# EAGLE schematic untitled (EAGLE 9.1.3)

## Sheet 1 of 6: led matrix
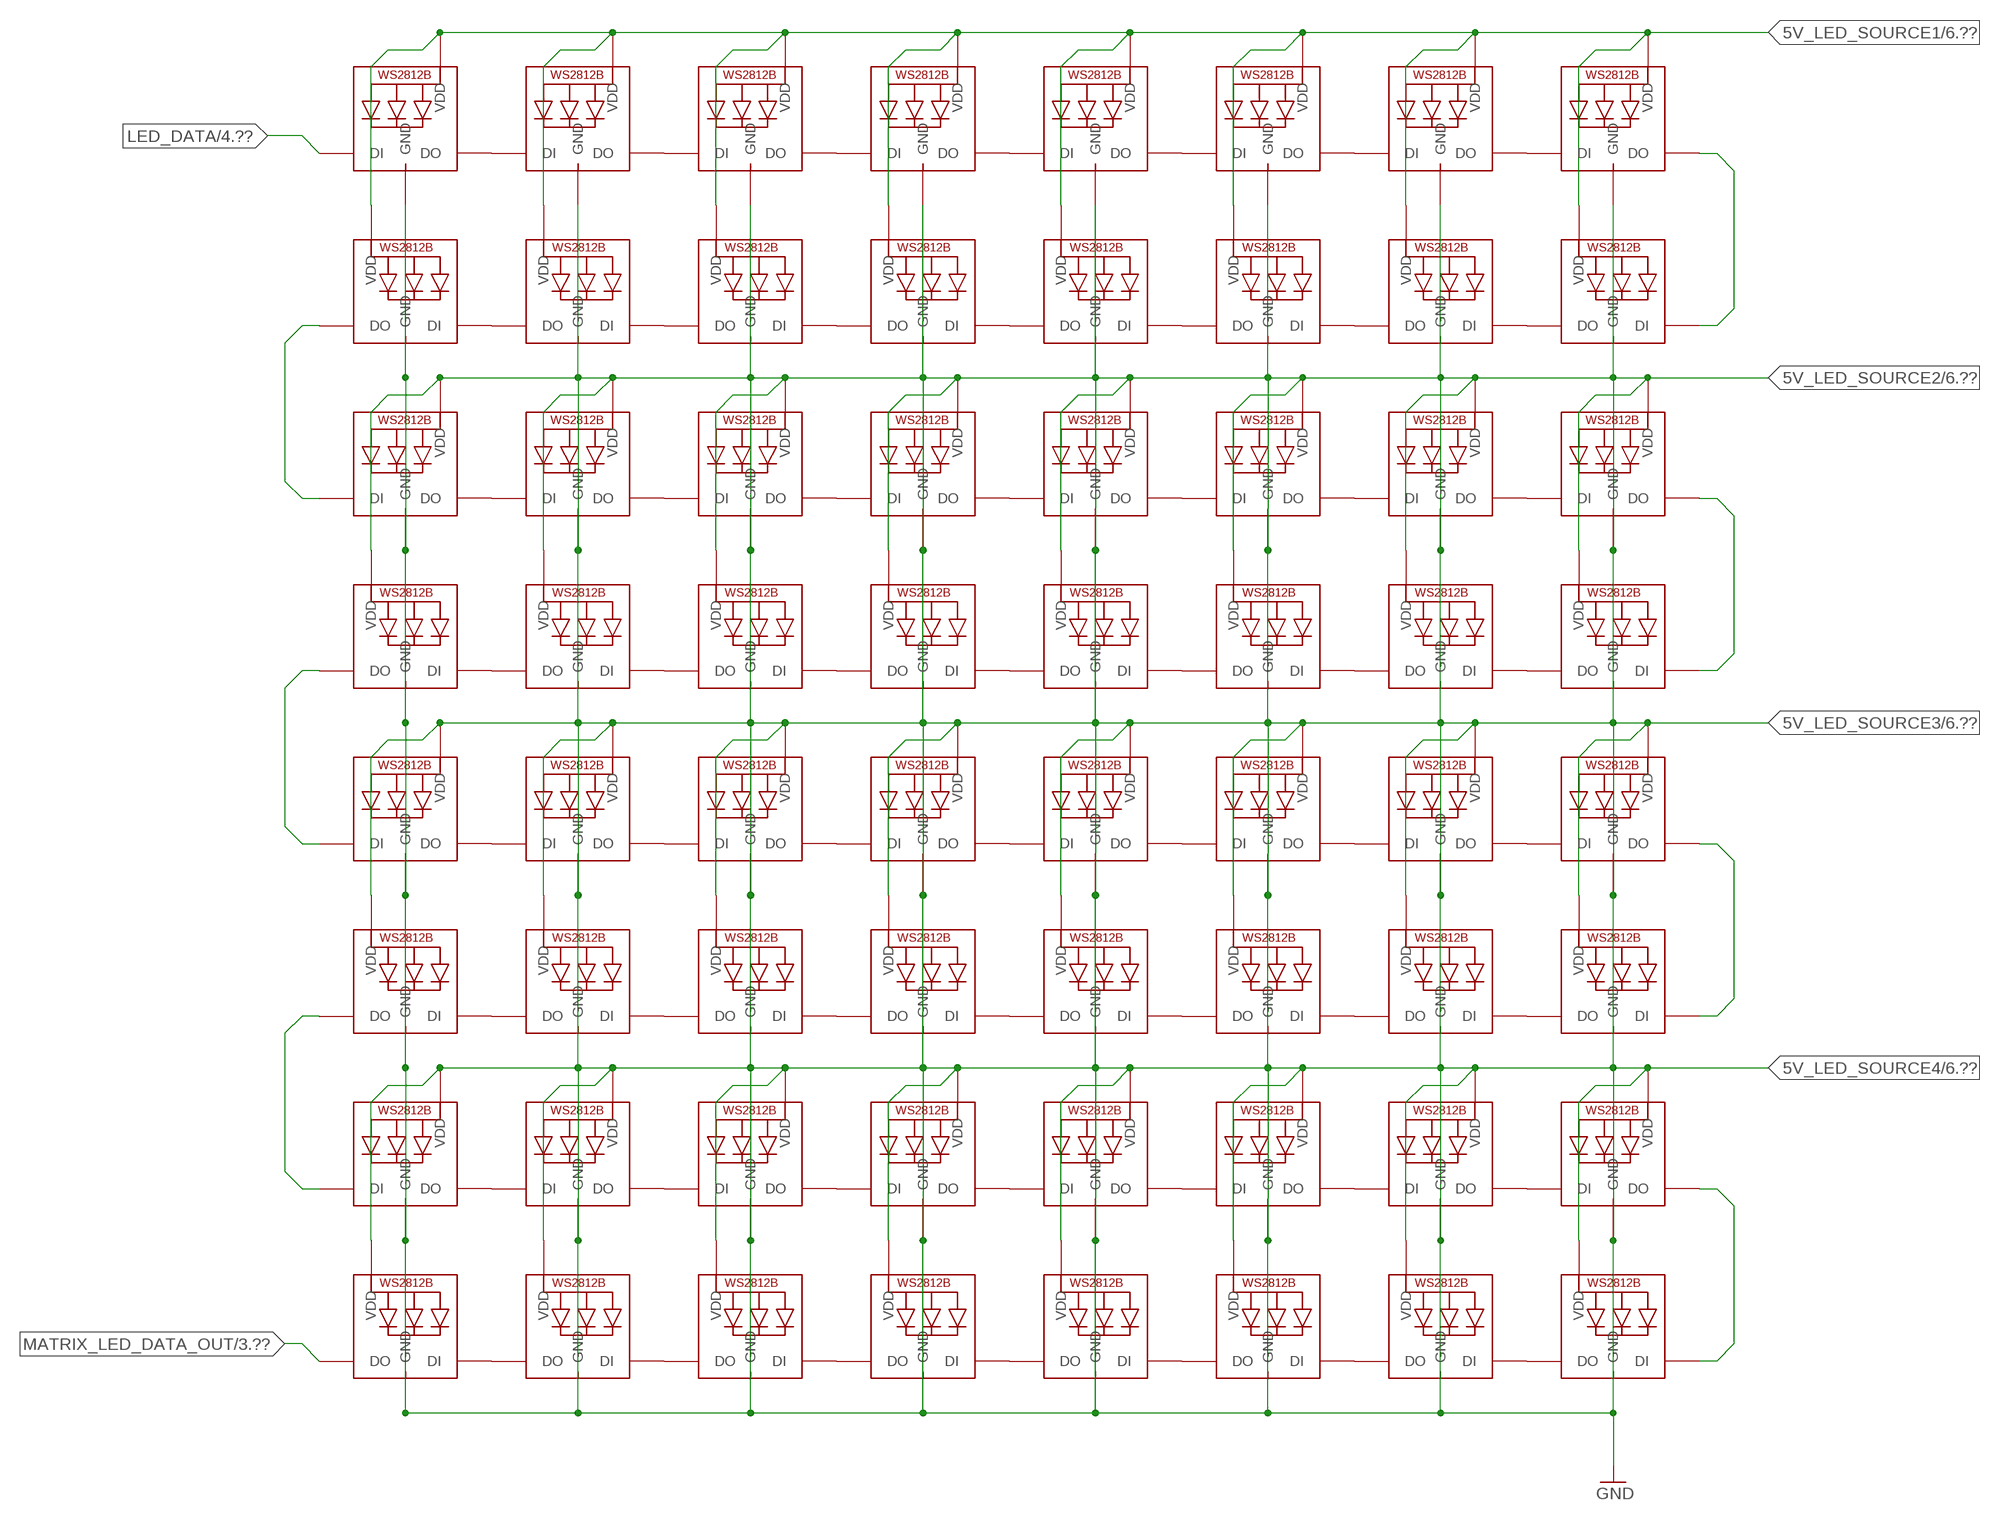
[diagram p0: schematic, sheet 1]

### Parts
LED1  WS2812B3535  [LED3535]
LED2  WS2812B3535  [LED3535]
LED3  WS2812B3535  [LED3535]
LED4  WS2812B3535  [LED3535]
LED5  WS2812B3535  [LED3535]
LED6  WS2812B3535  [LED3535]
LED7  WS2812B3535  [LED3535]
LED8  WS2812B3535  [LED3535]
LED9  WS2812B3535  [LED3535]
LED10  WS2812B3535  [LED3535]
LED11  WS2812B3535  [LED3535]
LED12  WS2812B3535  [LED3535]
LED13  WS2812B3535  [LED3535]
LED14  WS2812B3535  [LED3535]
LED15  WS2812B3535  [LED3535]
LED16  WS2812B3535  [LED3535]
LED17  WS2812B3535  [LED3535]
LED18  WS2812B3535  [LED3535]
LED19  WS2812B3535  [LED3535]
LED20  WS2812B3535  [LED3535]
LED21  WS2812B3535  [LED3535]
LED22  WS2812B3535  [LED3535]
LED23  WS2812B3535  [LED3535]
LED24  WS2812B3535  [LED3535]
LED25  WS2812B3535  [LED3535]
LED26  WS2812B3535  [LED3535]
LED27  WS2812B3535  [LED3535]
LED28  WS2812B3535  [LED3535]
LED29  WS2812B3535  [LED3535]
LED30  WS2812B3535  [LED3535]
LED31  WS2812B3535  [LED3535]
LED32  WS2812B3535  [LED3535]
LED33  WS2812B3535  [LED3535]
LED34  WS2812B3535  [LED3535]
LED35  WS2812B3535  [LED3535]
LED36  WS2812B3535  [LED3535]
LED37  WS2812B3535  [LED3535]
LED38  WS2812B3535  [LED3535]
LED39  WS2812B3535  [LED3535]
LED40  WS2812B3535  [LED3535]
LED41  WS2812B3535  [LED3535]
LED42  WS2812B3535  [LED3535]
LED43  WS2812B3535  [LED3535]
LED44  WS2812B3535  [LED3535]
LED45  WS2812B3535  [LED3535]
LED46  WS2812B3535  [LED3535]
LED47  WS2812B3535  [LED3535]
LED48  WS2812B3535  [LED3535]
LED49  WS2812B3535  [LED3535]
LED50  WS2812B3535  [LED3535]
LED51  WS2812B3535  [LED3535]
LED52  WS2812B3535  [LED3535]
LED53  WS2812B3535  [LED3535]
LED54  WS2812B3535  [LED3535]
LED55  WS2812B3535  [LED3535]
LED56  WS2812B3535  [LED3535]
LED57  WS2812B3535  [LED3535]
LED58  WS2812B3535  [LED3535]
LED59  WS2812B3535  [LED3535]
LED60  WS2812B3535  [LED3535]
LED61  WS2812B3535  [LED3535]
LED62  WS2812B3535  [LED3535]
LED63  WS2812B3535  [LED3535]
LED64  WS2812B3535  [LED3535]

### Nets
5V_LED_SOURCE1: LED1.2(VDD) LED2.2(VDD) LED3.2(VDD) LED4.2(VDD) LED5.2(VDD) LED6.2(VDD) LED7.2(VDD) LED8.2(VDD) LED9.2(VDD) LED10.2(VDD) LED11.2(VDD) LED12.2(VDD) LED13.2(VDD) LED14.2(VDD) LED15.2(VDD) LED16.2(VDD) ; also sheet 6
5V_LED_SOURCE2: LED17.2(VDD) LED18.2(VDD) LED19.2(VDD) LED20.2(VDD) LED21.2(VDD) LED22.2(VDD) LED23.2(VDD) LED24.2(VDD) LED25.2(VDD) LED26.2(VDD) LED27.2(VDD) LED28.2(VDD) LED29.2(VDD) LED30.2(VDD) LED31.2(VDD) LED32.2(VDD) ; also sheet 6
5V_LED_SOURCE3: LED33.2(VDD) LED34.2(VDD) LED35.2(VDD) LED36.2(VDD) LED37.2(VDD) LED38.2(VDD) LED39.2(VDD) LED40.2(VDD) LED41.2(VDD) LED42.2(VDD) LED43.2(VDD) LED44.2(VDD) LED45.2(VDD) LED46.2(VDD) LED47.2(VDD) LED48.2(VDD) ; also sheet 6
5V_LED_SOURCE4: LED49.2(VDD) LED50.2(VDD) LED51.2(VDD) LED52.2(VDD) LED53.2(VDD) LED54.2(VDD) LED55.2(VDD) LED56.2(VDD) LED57.2(VDD) LED58.2(VDD) LED59.2(VDD) LED60.2(VDD) LED61.2(VDD) LED62.2(VDD) LED63.2(VDD) LED64.2(VDD) ; also sheet 6
GND: LED1.4(GND) LED2.4(GND) LED3.4(GND) LED4.4(GND) LED5.4(GND) LED6.4(GND) LED7.4(GND) LED8.4(GND) LED9.4(GND) LED10.4(GND) LED11.4(GND) LED12.4(GND) LED13.4(GND) LED14.4(GND) LED15.4(GND) LED16.4(GND) LED17.4(GND) LED18.4(GND) LED19.4(GND) LED20.4(GND) LED21.4(GND) LED22.4(GND) LED23.4(GND) LED24.4(GND) LED25.4(GND) LED26.4(GND) LED27.4(GND) LED28.4(GND) LED29.4(GND) LED30.4(GND) LED31.4(GND) LED32.4(GND) LED33.4(GND) LED34.4(GND) LED35.4(GND) LED36.4(GND) LED37.4(GND) LED38.4(GND) LED39.4(GND) LED40.4(GND) LED41.4(GND) LED42.4(GND) LED43.4(GND) LED44.4(GND) LED45.4(GND) LED46.4(GND) LED47.4(GND) LED48.4(GND) LED49.4(GND) LED50.4(GND) LED51.4(GND) LED52.4(GND) LED53.4(GND) LED54.4(GND) LED55.4(GND) LED56.4(GND) LED57.4(GND) LED58.4(GND) LED59.4(GND) LED60.4(GND) LED61.4(GND) LED62.4(GND) LED63.4(GND) LED64.4(GND) ; also sheet 2,3,4,5,6
LED_DATA: LED1.1(DI) ; also sheet 4
MATRIX_LED_DATA_OUT: LED57.3(DO) ; also sheet 3
N$1: LED9.1(DI) LED10.3(DO)
N$2: LED10.1(DI) LED11.3(DO)
N$3: LED11.1(DI) LED12.3(DO)
N$4: LED12.1(DI) LED13.3(DO)
N$5: LED13.1(DI) LED14.3(DO)
N$6: LED14.1(DI) LED15.3(DO)
N$7: LED15.1(DI) LED16.3(DO)
N$8: LED25.1(DI) LED26.3(DO)
N$9: LED26.1(DI) LED27.3(DO)
N$10: LED27.1(DI) LED28.3(DO)
N$11: LED28.1(DI) LED29.3(DO)
N$12: LED29.1(DI) LED30.3(DO)
N$13: LED30.1(DI) LED31.3(DO)
N$14: LED31.1(DI) LED32.3(DO)
N$15: LED41.1(DI) LED42.3(DO)
N$16: LED42.1(DI) LED43.3(DO)
N$17: LED43.1(DI) LED44.3(DO)
N$18: LED44.1(DI) LED45.3(DO)
N$19: LED45.1(DI) LED46.3(DO)
N$20: LED46.1(DI) LED47.3(DO)
N$21: LED47.1(DI) LED48.3(DO)
N$22: LED1.3(DO) LED2.1(DI)
N$23: LED2.3(DO) LED3.1(DI)
N$24: LED3.3(DO) LED4.1(DI)
N$25: LED4.3(DO) LED5.1(DI)
N$26: LED5.3(DO) LED6.1(DI)
N$27: LED6.3(DO) LED7.1(DI)
N$28: LED7.3(DO) LED8.1(DI)
N$29: LED57.1(DI) LED58.3(DO)
N$30: LED24.3(DO) LED32.1(DI)
N$31: LED40.3(DO) LED48.1(DI)
N$32: LED56.3(DO) LED64.1(DI)
N$33: LED41.3(DO) LED49.1(DI)
N$34: LED25.3(DO) LED33.1(DI)
N$35: LED9.3(DO) LED17.1(DI)
N$36: LED58.1(DI) LED59.3(DO)
N$37: LED59.1(DI) LED60.3(DO)
N$38: LED60.1(DI) LED61.3(DO)
N$39: LED61.1(DI) LED62.3(DO)
N$40: LED62.1(DI) LED63.3(DO)
N$41: LED63.1(DI) LED64.3(DO)
N$45: LED17.3(DO) LED18.1(DI)
N$46: LED18.3(DO) LED19.1(DI)
N$47: LED19.3(DO) LED20.1(DI)
N$48: LED20.3(DO) LED21.1(DI)
N$49: LED21.3(DO) LED22.1(DI)
N$50: LED22.3(DO) LED23.1(DI)
N$51: LED23.3(DO) LED24.1(DI)
N$68: LED33.3(DO) LED34.1(DI)
N$69: LED34.3(DO) LED35.1(DI)
N$70: LED35.3(DO) LED36.1(DI)
N$71: LED36.3(DO) LED37.1(DI)
N$72: LED37.3(DO) LED38.1(DI)
N$73: LED38.3(DO) LED39.1(DI)
N$74: LED39.3(DO) LED40.1(DI)
N$91: LED49.3(DO) LED50.1(DI)
N$92: LED50.3(DO) LED51.1(DI)
N$93: LED51.3(DO) LED52.1(DI)
N$94: LED52.3(DO) LED53.1(DI)
N$95: LED53.3(DO) LED54.1(DI)
N$96: LED54.3(DO) LED55.1(DI)
N$97: LED55.3(DO) LED56.1(DI)
N$114: LED8.3(DO) LED16.1(DI)

## Sheet 2 of 6: button matrix
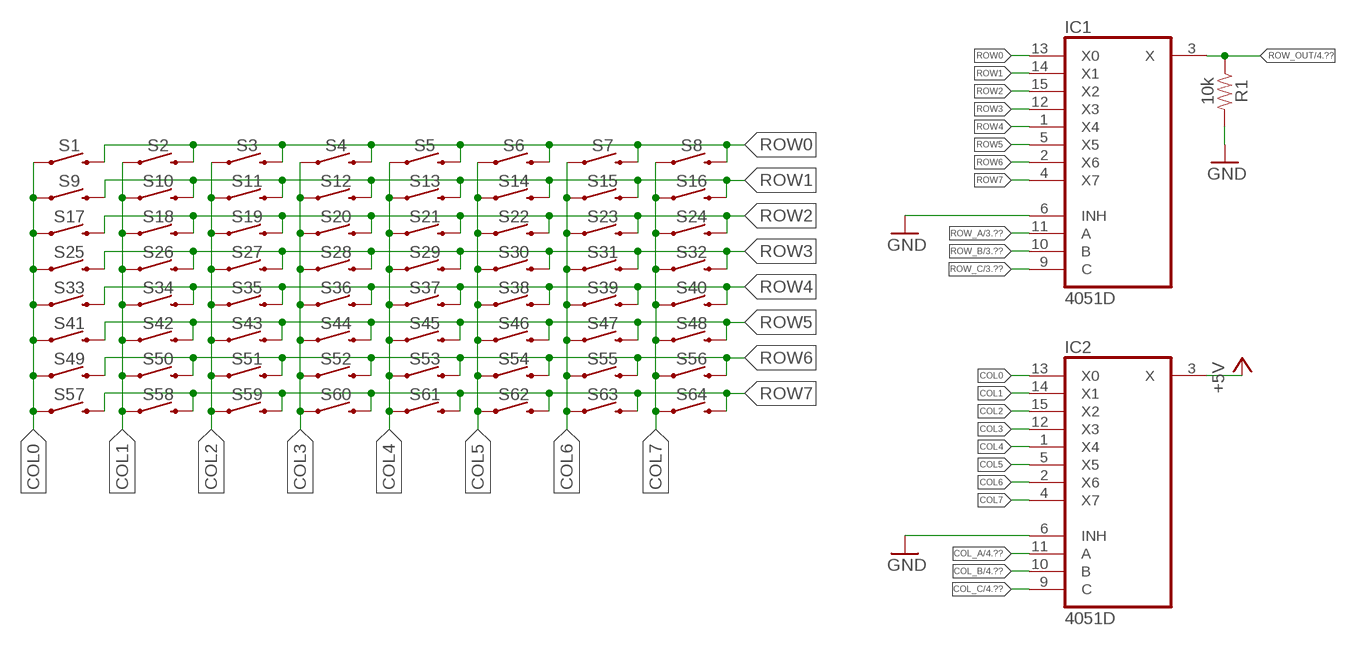
[diagram p1: schematic, sheet 2]

### Parts
IC1  4051D  [SO16]
IC2  4051D  [SO16]
R1  10k  10KOHM-0603-1/10W-1%  [0603]
S1  MOMENTARY-SWITCH-SPST-SMD-6.0X3.5MM  [TACTILE_SWITCH_SMD_6.0X3.5MM]
S2  MOMENTARY-SWITCH-SPST-SMD-6.0X3.5MM  [TACTILE_SWITCH_SMD_6.0X3.5MM]
S3  MOMENTARY-SWITCH-SPST-SMD-6.0X3.5MM  [TACTILE_SWITCH_SMD_6.0X3.5MM]
S4  MOMENTARY-SWITCH-SPST-SMD-6.0X3.5MM  [TACTILE_SWITCH_SMD_6.0X3.5MM]
S5  MOMENTARY-SWITCH-SPST-SMD-6.0X3.5MM  [TACTILE_SWITCH_SMD_6.0X3.5MM]
S6  MOMENTARY-SWITCH-SPST-SMD-6.0X3.5MM  [TACTILE_SWITCH_SMD_6.0X3.5MM]
S7  MOMENTARY-SWITCH-SPST-SMD-6.0X3.5MM  [TACTILE_SWITCH_SMD_6.0X3.5MM]
S8  MOMENTARY-SWITCH-SPST-SMD-6.0X3.5MM  [TACTILE_SWITCH_SMD_6.0X3.5MM]
S9  MOMENTARY-SWITCH-SPST-SMD-6.0X3.5MM  [TACTILE_SWITCH_SMD_6.0X3.5MM]
S10  MOMENTARY-SWITCH-SPST-SMD-6.0X3.5MM  [TACTILE_SWITCH_SMD_6.0X3.5MM]
S11  MOMENTARY-SWITCH-SPST-SMD-6.0X3.5MM  [TACTILE_SWITCH_SMD_6.0X3.5MM]
S12  MOMENTARY-SWITCH-SPST-SMD-6.0X3.5MM  [TACTILE_SWITCH_SMD_6.0X3.5MM]
S13  MOMENTARY-SWITCH-SPST-SMD-6.0X3.5MM  [TACTILE_SWITCH_SMD_6.0X3.5MM]
S14  MOMENTARY-SWITCH-SPST-SMD-6.0X3.5MM  [TACTILE_SWITCH_SMD_6.0X3.5MM]
S15  MOMENTARY-SWITCH-SPST-SMD-6.0X3.5MM  [TACTILE_SWITCH_SMD_6.0X3.5MM]
S16  MOMENTARY-SWITCH-SPST-SMD-6.0X3.5MM  [TACTILE_SWITCH_SMD_6.0X3.5MM]
S17  MOMENTARY-SWITCH-SPST-SMD-6.0X3.5MM  [TACTILE_SWITCH_SMD_6.0X3.5MM]
S18  MOMENTARY-SWITCH-SPST-SMD-6.0X3.5MM  [TACTILE_SWITCH_SMD_6.0X3.5MM]
S19  MOMENTARY-SWITCH-SPST-SMD-6.0X3.5MM  [TACTILE_SWITCH_SMD_6.0X3.5MM]
S20  MOMENTARY-SWITCH-SPST-SMD-6.0X3.5MM  [TACTILE_SWITCH_SMD_6.0X3.5MM]
S21  MOMENTARY-SWITCH-SPST-SMD-6.0X3.5MM  [TACTILE_SWITCH_SMD_6.0X3.5MM]
S22  MOMENTARY-SWITCH-SPST-SMD-6.0X3.5MM  [TACTILE_SWITCH_SMD_6.0X3.5MM]
S23  MOMENTARY-SWITCH-SPST-SMD-6.0X3.5MM  [TACTILE_SWITCH_SMD_6.0X3.5MM]
S24  MOMENTARY-SWITCH-SPST-SMD-6.0X3.5MM  [TACTILE_SWITCH_SMD_6.0X3.5MM]
S25  MOMENTARY-SWITCH-SPST-SMD-6.0X3.5MM  [TACTILE_SWITCH_SMD_6.0X3.5MM]
S26  MOMENTARY-SWITCH-SPST-SMD-6.0X3.5MM  [TACTILE_SWITCH_SMD_6.0X3.5MM]
S27  MOMENTARY-SWITCH-SPST-SMD-6.0X3.5MM  [TACTILE_SWITCH_SMD_6.0X3.5MM]
S28  MOMENTARY-SWITCH-SPST-SMD-6.0X3.5MM  [TACTILE_SWITCH_SMD_6.0X3.5MM]
S29  MOMENTARY-SWITCH-SPST-SMD-6.0X3.5MM  [TACTILE_SWITCH_SMD_6.0X3.5MM]
S30  MOMENTARY-SWITCH-SPST-SMD-6.0X3.5MM  [TACTILE_SWITCH_SMD_6.0X3.5MM]
S31  MOMENTARY-SWITCH-SPST-SMD-6.0X3.5MM  [TACTILE_SWITCH_SMD_6.0X3.5MM]
S32  MOMENTARY-SWITCH-SPST-SMD-6.0X3.5MM  [TACTILE_SWITCH_SMD_6.0X3.5MM]
S33  MOMENTARY-SWITCH-SPST-SMD-6.0X3.5MM  [TACTILE_SWITCH_SMD_6.0X3.5MM]
S34  MOMENTARY-SWITCH-SPST-SMD-6.0X3.5MM  [TACTILE_SWITCH_SMD_6.0X3.5MM]
S35  MOMENTARY-SWITCH-SPST-SMD-6.0X3.5MM  [TACTILE_SWITCH_SMD_6.0X3.5MM]
S36  MOMENTARY-SWITCH-SPST-SMD-6.0X3.5MM  [TACTILE_SWITCH_SMD_6.0X3.5MM]
S37  MOMENTARY-SWITCH-SPST-SMD-6.0X3.5MM  [TACTILE_SWITCH_SMD_6.0X3.5MM]
S38  MOMENTARY-SWITCH-SPST-SMD-6.0X3.5MM  [TACTILE_SWITCH_SMD_6.0X3.5MM]
S39  MOMENTARY-SWITCH-SPST-SMD-6.0X3.5MM  [TACTILE_SWITCH_SMD_6.0X3.5MM]
S40  MOMENTARY-SWITCH-SPST-SMD-6.0X3.5MM  [TACTILE_SWITCH_SMD_6.0X3.5MM]
S41  MOMENTARY-SWITCH-SPST-SMD-6.0X3.5MM  [TACTILE_SWITCH_SMD_6.0X3.5MM]
S42  MOMENTARY-SWITCH-SPST-SMD-6.0X3.5MM  [TACTILE_SWITCH_SMD_6.0X3.5MM]
S43  MOMENTARY-SWITCH-SPST-SMD-6.0X3.5MM  [TACTILE_SWITCH_SMD_6.0X3.5MM]
S44  MOMENTARY-SWITCH-SPST-SMD-6.0X3.5MM  [TACTILE_SWITCH_SMD_6.0X3.5MM]
S45  MOMENTARY-SWITCH-SPST-SMD-6.0X3.5MM  [TACTILE_SWITCH_SMD_6.0X3.5MM]
S46  MOMENTARY-SWITCH-SPST-SMD-6.0X3.5MM  [TACTILE_SWITCH_SMD_6.0X3.5MM]
S47  MOMENTARY-SWITCH-SPST-SMD-6.0X3.5MM  [TACTILE_SWITCH_SMD_6.0X3.5MM]
S48  MOMENTARY-SWITCH-SPST-SMD-6.0X3.5MM  [TACTILE_SWITCH_SMD_6.0X3.5MM]
S49  MOMENTARY-SWITCH-SPST-SMD-6.0X3.5MM  [TACTILE_SWITCH_SMD_6.0X3.5MM]
S50  MOMENTARY-SWITCH-SPST-SMD-6.0X3.5MM  [TACTILE_SWITCH_SMD_6.0X3.5MM]
S51  MOMENTARY-SWITCH-SPST-SMD-6.0X3.5MM  [TACTILE_SWITCH_SMD_6.0X3.5MM]
S52  MOMENTARY-SWITCH-SPST-SMD-6.0X3.5MM  [TACTILE_SWITCH_SMD_6.0X3.5MM]
S53  MOMENTARY-SWITCH-SPST-SMD-6.0X3.5MM  [TACTILE_SWITCH_SMD_6.0X3.5MM]
S54  MOMENTARY-SWITCH-SPST-SMD-6.0X3.5MM  [TACTILE_SWITCH_SMD_6.0X3.5MM]
S55  MOMENTARY-SWITCH-SPST-SMD-6.0X3.5MM  [TACTILE_SWITCH_SMD_6.0X3.5MM]
S56  MOMENTARY-SWITCH-SPST-SMD-6.0X3.5MM  [TACTILE_SWITCH_SMD_6.0X3.5MM]
S57  MOMENTARY-SWITCH-SPST-SMD-6.0X3.5MM  [TACTILE_SWITCH_SMD_6.0X3.5MM]
S58  MOMENTARY-SWITCH-SPST-SMD-6.0X3.5MM  [TACTILE_SWITCH_SMD_6.0X3.5MM]
S59  MOMENTARY-SWITCH-SPST-SMD-6.0X3.5MM  [TACTILE_SWITCH_SMD_6.0X3.5MM]
S60  MOMENTARY-SWITCH-SPST-SMD-6.0X3.5MM  [TACTILE_SWITCH_SMD_6.0X3.5MM]
S61  MOMENTARY-SWITCH-SPST-SMD-6.0X3.5MM  [TACTILE_SWITCH_SMD_6.0X3.5MM]
S62  MOMENTARY-SWITCH-SPST-SMD-6.0X3.5MM  [TACTILE_SWITCH_SMD_6.0X3.5MM]
S63  MOMENTARY-SWITCH-SPST-SMD-6.0X3.5MM  [TACTILE_SWITCH_SMD_6.0X3.5MM]
S64  MOMENTARY-SWITCH-SPST-SMD-6.0X3.5MM  [TACTILE_SWITCH_SMD_6.0X3.5MM]

### Nets
+5V: IC2.3(X) ; also sheet 3,4,5,6
COL0: IC2.13(X0) S1.1 S9.1 S17.1 S25.1 S33.1 S41.1 S49.1 S57.1
COL1: IC2.14(X1) S2.1 S10.1 S18.1 S26.1 S34.1 S42.1 S50.1 S58.1
COL2: IC2.15(X2) S3.1 S11.1 S19.1 S27.1 S35.1 S43.1 S51.1 S59.1
COL3: IC2.12(X3) S4.1 S12.1 S20.1 S28.1 S36.1 S44.1 S52.1 S60.1
COL4: IC2.1(X4) S5.1 S13.1 S21.1 S29.1 S37.1 S45.1 S53.1 S61.1
COL5: IC2.5(X5) S6.1 S14.1 S22.1 S30.1 S38.1 S46.1 S54.1 S62.1
COL6: IC2.2(X6) S7.1 S15.1 S23.1 S31.1 S39.1 S47.1 S55.1 S63.1
COL7: IC2.4(X7) S8.1 S16.1 S24.1 S32.1 S40.1 S48.1 S56.1 S64.1
COL_A: IC2.11(A) ; also sheet 4
COL_B: IC2.10(B) ; also sheet 4
COL_C: IC2.9(C) ; also sheet 4
GND: IC1.6(INH) IC2.6(INH) R1.2 ; also sheet 1,3,4,5,6
ROW0: IC1.13(X0) S1.2 S2.2 S3.2 S4.2 S5.2 S6.2 S7.2 S8.2
ROW1: IC1.14(X1) S9.2 S10.2 S11.2 S12.2 S13.2 S14.2 S15.2 S16.2
ROW2: IC1.15(X2) S17.2 S18.2 S19.2 S20.2 S21.2 S22.2 S23.2 S24.2
ROW3: IC1.12(X3) S25.2 S26.2 S27.2 S28.2 S29.2 S30.2 S31.2 S32.2
ROW4: IC1.1(X4) S33.2 S34.2 S35.2 S36.2 S37.2 S38.2 S39.2 S40.2
ROW5: IC1.5(X5) S41.2 S42.2 S43.2 S44.2 S45.2 S46.2 S47.2 S48.2
ROW6: IC1.2(X6) S49.2 S50.2 S51.2 S52.2 S53.2 S54.2 S55.2 S56.2
ROW7: IC1.4(X7) S57.2 S58.2 S59.2 S60.2 S61.2 S62.2 S63.2 S64.2
ROW_A: IC1.11(A) ; also sheet 3,4
ROW_B: IC1.10(B) ; also sheet 3,4
ROW_C: IC1.9(C) ; also sheet 3,4
ROW_OUT: IC1.3(X) R1.1 ; also sheet 4

## Sheet 3 of 6: outs, ins, pots, leds, controls
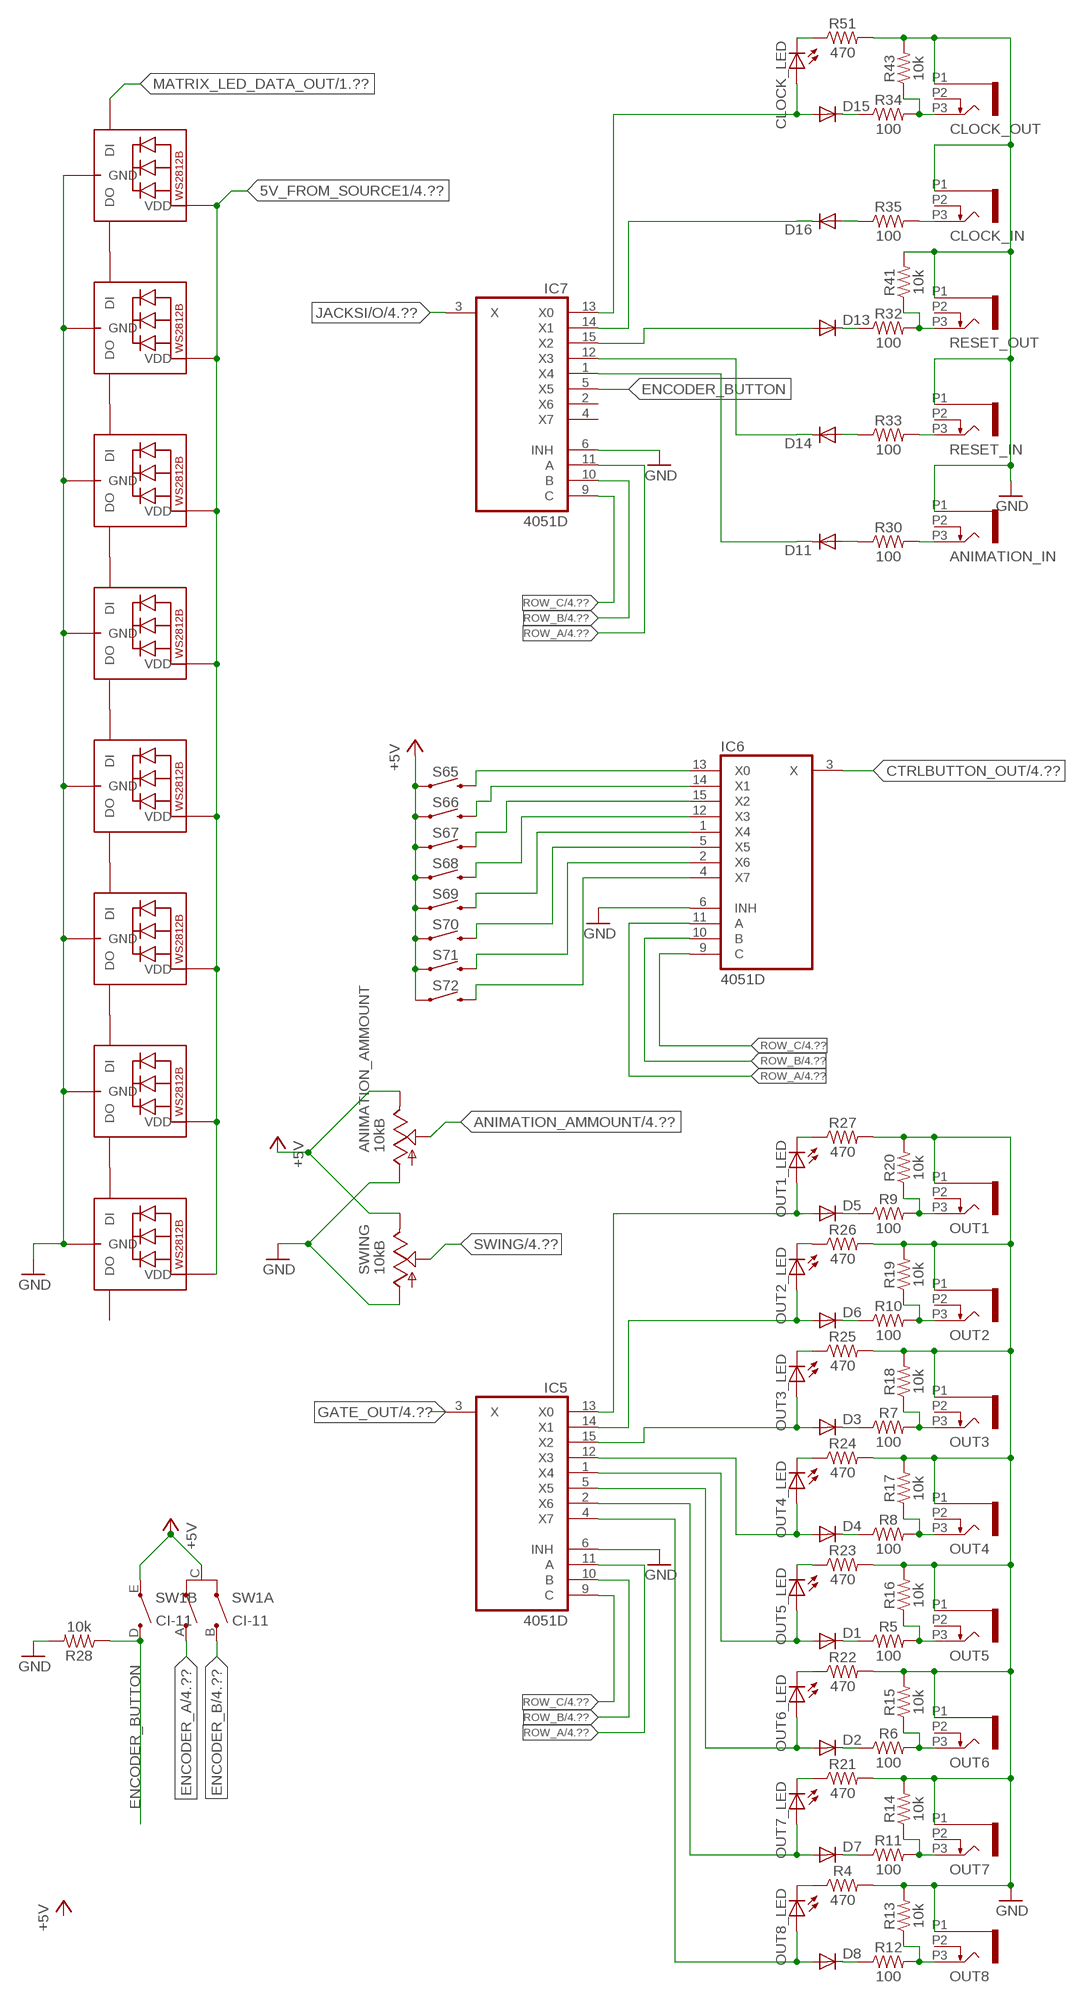
[diagram p2: schematic, sheet 3]

### Parts
ANIMATION_AMMOUNT  10kB  POT_USVERTICAL  [ALPS_POT_VERTICAL]
ANIMATION_IN  PJ301_THONKICONN8  [WQP_PJ_301M8]
CLOCK_IN  PJ301_THONKICONN1  [WQP_PJ_301M1]
CLOCK_LED  LED5MM  [LED5MM]
CLOCK_OUT  PJ301_THONKICONN1  [WQP_PJ_301M1]
D1  DIODE-DO214AC  [DO214AC]
D2  DIODE-DO214AC  [DO214AC]
D3  DIODE-DO214AC  [DO214AC]
D4  DIODE-DO214AC  [DO214AC]
D5  DIODE-DO214AC  [DO214AC]
D6  DIODE-DO214AC  [DO214AC]
D7  DIODE-DO214AC  [DO214AC]
D8  DIODE-DO214AC  [DO214AC]
D11  DIODE-DO214AC  [DO214AC]
D13  DIODE-DO214AC  [DO214AC]
D14  DIODE-DO214AC  [DO214AC]
D15  DIODE-DO214AC  [DO214AC]
D16  DIODE-DO214AC  [DO214AC]
IC5  4051D  [SO16]
IC6  4051D  [SO16]
IC7  4051D  [SO16]
LED65  WS2812B3535  [LED3535]
LED66  WS2812B3535  [LED3535]
LED67  WS2812B3535  [LED3535]
LED68  WS2812B3535  [LED3535]
LED69  WS2812B3535  [LED3535]
LED70  WS2812B3535  [LED3535]
LED71  WS2812B3535  [LED3535]
LED72  WS2812B3535  [LED3535]
OUT1  PJ301_THONKICONN1  [WQP_PJ_301M1]
OUT1_LED  LED5MM  [LED5MM]
OUT2  PJ301_THONKICONN1  [WQP_PJ_301M1]
OUT2_LED  LED5MM  [LED5MM]
OUT3  PJ301_THONKICONN1  [WQP_PJ_301M1]
OUT3_LED  LED5MM  [LED5MM]
OUT4  PJ301_THONKICONN1  [WQP_PJ_301M1]
OUT4_LED  LED5MM  [LED5MM]
OUT5  PJ301_THONKICONN1  [WQP_PJ_301M1]
OUT5_LED  LED5MM  [LED5MM]
OUT6  PJ301_THONKICONN1  [WQP_PJ_301M1]
OUT6_LED  LED5MM  [LED5MM]
OUT7  PJ301_THONKICONN8  [WQP_PJ_301M8]
OUT7_LED  LED5MM  [LED5MM]
OUT8  PJ301_THONKICONN8  [WQP_PJ_301M8]
OUT8_LED  LED5MM  [LED5MM]
R4  470  470OHM-0603-1/10W-1%  [0603]
R5  100  100OHM-0603-1/4W-5%  [0603]
R6  100  100OHM-0603-1/4W-5%  [0603]
R7  100  100OHM-0603-1/4W-5%  [0603]
R8  100  100OHM-0603-1/4W-5%  [0603]
R9  100  100OHM-0603-1/4W-5%  [0603]
R10  100  100OHM-0603-1/4W-5%  [0603]
R11  100  100OHM-0603-1/4W-5%  [0603]
R12  100  100OHM-0603-1/4W-5%  [0603]
R13  10k  10KOHM-0603-1/10W-1%  [0603]
R14  10k  10KOHM-0603-1/10W-1%  [0603]
R15  10k  10KOHM-0603-1/10W-1%  [0603]
R16  10k  10KOHM-0603-1/10W-1%  [0603]
R17  10k  10KOHM-0603-1/10W-1%  [0603]
R18  10k  10KOHM-0603-1/10W-1%  [0603]
R19  10k  10KOHM-0603-1/10W-1%  [0603]
R20  10k  10KOHM-0603-1/10W-1%  [0603]
R21  470  470OHM-0603-1/10W-1%  [0603]
R22  470  470OHM-0603-1/10W-1%  [0603]
R23  470  470OHM-0603-1/10W-1%  [0603]
R24  470  470OHM-0603-1/10W-1%  [0603]
R25  470  470OHM-0603-1/10W-1%  [0603]
R26  470  470OHM-0603-1/10W-1%  [0603]
R27  470  470OHM-0603-1/10W-1%  [0603]
R28  10k  10KOHM-0603-1/10W-1%  [0603]
R30  100  100OHM-0603-1/4W-5%  [0603]
R32  100  100OHM-0603-1/4W-5%  [0603]
R33  100  100OHM-0603-1/4W-5%  [0603]
R34  100  100OHM-0603-1/4W-5%  [0603]
R35  100  100OHM-0603-1/4W-5%  [0603]
R41  10k  10KOHM-0603-1/10W-1%  [0603]
R43  10k  10KOHM-0603-1/10W-1%  [0603]
R51  470  470OHM-0603-1/10W-1%  [0603]
RESET_IN  PJ301_THONKICONN1  [WQP_PJ_301M1]
RESET_OUT  PJ301_THONKICONN8  [WQP_PJ_301M8]
S65  MOMENTARY-SWITCH-SPST-SMD-6.0X3.5MM  [TACTILE_SWITCH_SMD_6.0X3.5MM]
S66  MOMENTARY-SWITCH-SPST-SMD-6.0X3.5MM  [TACTILE_SWITCH_SMD_6.0X3.5MM]
S67  MOMENTARY-SWITCH-SPST-SMD-6.0X3.5MM  [TACTILE_SWITCH_SMD_6.0X3.5MM]
S68  MOMENTARY-SWITCH-SPST-SMD-6.0X3.5MM  [TACTILE_SWITCH_SMD_6.0X3.5MM]
S69  MOMENTARY-SWITCH-SPST-SMD-6.0X3.5MM  [TACTILE_SWITCH_SMD_6.0X3.5MM]
S70  MOMENTARY-SWITCH-SPST-SMD-6.0X3.5MM  [TACTILE_SWITCH_SMD_6.0X3.5MM]
S71  MOMENTARY-SWITCH-SPST-SMD-6.0X3.5MM  [TACTILE_SWITCH_SMD_6.0X3.5MM]
S72  MOMENTARY-SWITCH-SPST-SMD-6.0X3.5MM  [TACTILE_SWITCH_SMD_6.0X3.5MM]
SW1  CI-11  [CI-11]
SWING  10kB  POT_USVERTICAL  [ALPS_POT_VERTICAL]

### Nets
5V_FROM_SOURCE1: LED65.2(VDD) LED66.2(VDD) LED67.2(VDD) LED68.2(VDD) LED69.2(VDD) LED70.2(VDD) LED71.2(VDD) LED72.2(VDD) ; also sheet 4,6
+5V: ANIMATION_AMMOUNT.P$1(E) S65.1 S66.1 S67.1 S68.1 S69.1 S70.1 S71.1 S72.1 SW1.C(A:C) SW1.E(B:E) SWING.P$1(E) ; also sheet 2,4,5,6
ANIMATION_AMMOUNT: ANIMATION_AMMOUNT.P$2(S) ; also sheet 4
CTRLBUTTON_OUT: IC6.3(X) ; also sheet 4
ENCODER_A: SW1.A(A:A) ; also sheet 4
ENCODER_B: SW1.B(A:B) ; also sheet 4
ENCODER_BUTTON: IC7.5(X5) R28.1 SW1.D(B:D)
GATE_OUT: IC5.3(X) ; also sheet 4
GND: ANIMATION_AMMOUNT.P$3(A) ANIMATION_IN.P1 CLOCK_IN.P1 CLOCK_OUT.P1 IC5.6(INH) IC6.6(INH) IC7.6(INH) LED65.4(GND) LED66.4(GND) LED67.4(GND) LED68.4(GND) LED69.4(GND) LED70.4(GND) LED71.4(GND) LED72.4(GND) OUT1.P1 OUT2.P1 OUT3.P1 OUT4.P1 OUT5.P1 OUT6.P1 OUT7.P1 OUT8.P1 R4.2 R13.2 R14.2 R15.2 R16.2 R17.2 R18.2 R19.2 R20.2 R21.2 R22.2 R23.2 R24.2 R25.2 R26.2 R27.2 R28.2 R41.2 R43.2 R51.2 RESET_IN.P1 RESET_OUT.P1 SWING.P$3(A) ; also sheet 1,2,4,5,6
JACKSI/O: IC7.3(X) ; also sheet 4
MATRIX_LED_DATA_OUT: LED72.1(DI) ; also sheet 1
N$55: D1.C R5.1
N$56: D2.C R6.1
N$60: OUT6.P3 R6.2 R15.1
N$61: OUT5.P3 R5.2 R16.1
N$62: D3.C R7.1
N$63: D4.C R8.1
N$64: D7.C R11.1
N$65: D8.C R12.1
N$66: OUT8.P3 R12.2 R13.1
N$67: OUT7.P3 R11.2 R14.1
N$75: OUT4.P3 R8.2 R17.1
N$76: OUT3.P3 R7.2 R18.1
N$77: D5.C R9.1
N$78: D6.C R10.1
N$79: OUT2.P3 R10.2 R19.1
N$80: OUT1.P3 R9.2 R20.1
N$81: D5.A IC5.13(X0) OUT1_LED.A
N$82: D6.A IC5.14(X1) OUT2_LED.A
N$83: D3.A IC5.15(X2) OUT3_LED.A
N$84: D4.A IC5.12(X3) OUT4_LED.A
N$85: D1.A IC5.1(X4) OUT5_LED.A
N$86: D2.A IC5.5(X5) OUT6_LED.A
N$87: D7.A IC5.2(X6) OUT7_LED.A
N$88: D8.A IC5.4(X7) OUT8_LED.A
N$89: LED65.3(DO) LED66.1(DI)
N$90: LED65.1(DI) LED70.3(DO)
N$98: LED66.3(DO) LED67.1(DI)
N$99: LED67.3(DO) LED68.1(DI)
N$100: LED68.3(DO) LED69.1(DI)
N$101: LED69.3(DO) LED71.1(DI)
N$102: LED70.1(DI) LED72.3(DO)
N$104: OUT1_LED.K(C) R27.1
N$105: OUT2_LED.K(C) R26.1
N$107: OUT3_LED.K(C) R25.1
N$108: OUT4_LED.K(C) R24.1
N$109: OUT5_LED.K(C) R23.1
N$110: OUT6_LED.K(C) R22.1
N$111: OUT7_LED.K(C) R21.1
N$112: OUT8_LED.K(C) R4.1
N$115: D16.A R35.1
N$116: D14.A R33.1
N$117: D11.A R30.1
N$121: ANIMATION_IN.P3 R30.2
N$122: D13.C R32.1
N$124: R33.2 RESET_IN.P3
N$125: R32.2 R41.1 RESET_OUT.P3
N$126: D15.C R34.1
N$128: CLOCK_IN.P3 R35.2
N$129: CLOCK_OUT.P3 R34.2 R43.1
N$130: CLOCK_LED.A D15.A IC7.13(X0)
N$131: D16.C IC7.14(X1)
N$132: D13.A IC7.15(X2)
N$133: D14.C IC7.12(X3)
N$134: D11.C IC7.1(X4)
N$138: CLOCK_LED.K(C) R51.1
ROW8: IC6.13(X0) S65.2
ROW9: IC6.14(X1) S66.2
ROW10: IC6.15(X2) S67.2
ROW11: IC6.12(X3) S68.2
ROW12: IC6.1(X4) S69.2
ROW13: IC6.5(X5) S70.2
ROW14: IC6.2(X6) S71.2
ROW15: IC6.4(X7) S72.2
ROW_A: IC5.11(A) IC6.11(A) IC7.11(A) ; also sheet 2,4
ROW_B: IC5.10(B) IC6.10(B) IC7.10(B) ; also sheet 2,4
ROW_C: IC5.9(C) IC6.9(C) IC7.9(C) ; also sheet 2,4
SWING: SWING.P$2(S) ; also sheet 4
Unconnected: ANIMATION_IN.P2 CLOCK_IN.P2 CLOCK_OUT.P2 IC7.2(X6) IC7.4(X7) LED71.3(DO) OUT1.P2 OUT2.P2 OUT3.P2 OUT4.P2 OUT5.P2 OUT6.P2 OUT7.P2 OUT8.P2 RESET_IN.P2 RESET_OUT.P2

## Sheet 4 of 6: CPU
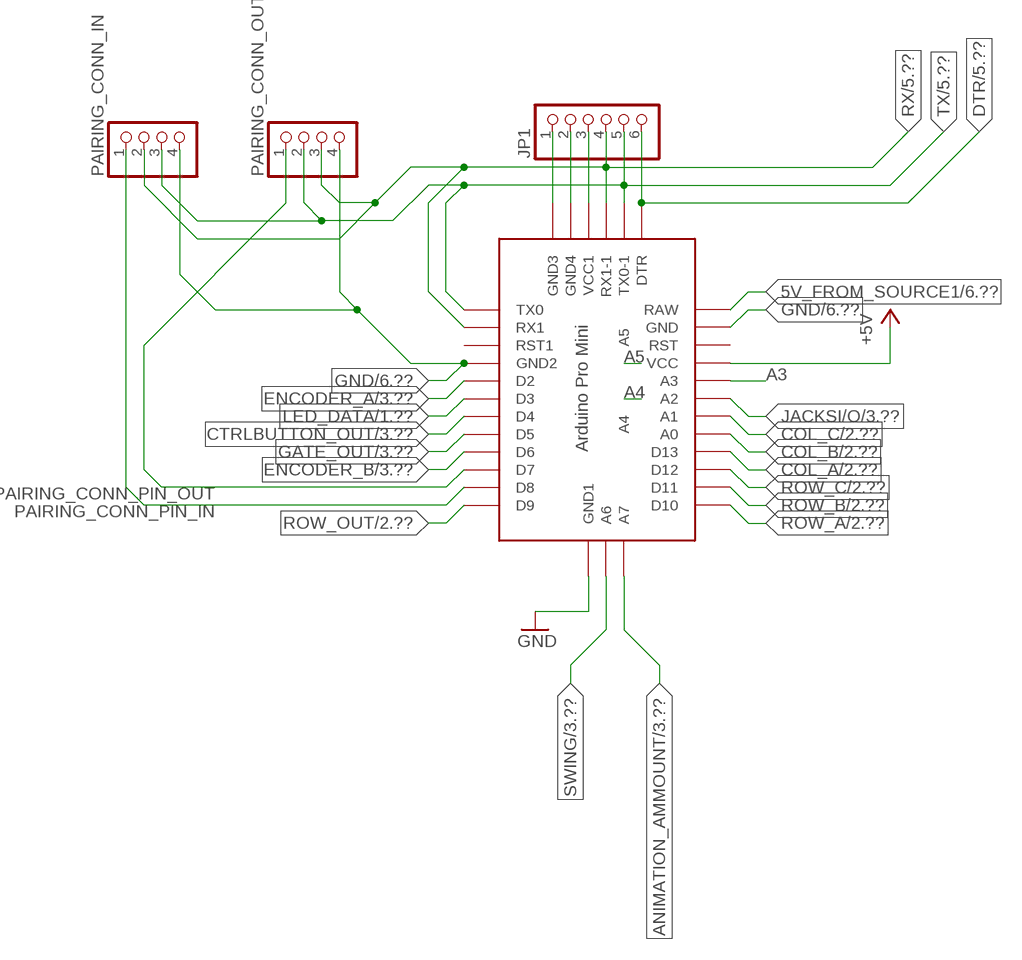
[diagram p3: schematic, sheet 4]

### Parts
JP1  PINHD-1X6  [1X06]
PAIRING_CONN_IN  PINHD-1X4  [1X04]
PAIRING_CONN_OUT  PINHD-1X4  [1X04]
U$1  ABK-PRO-MINI  [ABK-PRO-MINI]

### Nets
5V_FROM_SOURCE1: U$1.RAW ; also sheet 3,6
+5V: JP1.3 U$1.VCC U$1.VCC1 ; also sheet 2,3,5,6
A3: U$1.A3
A4: U$1.A4
A5: U$1.A5
ANIMATION_AMMOUNT: U$1.A7 ; also sheet 3
COL_A: U$1.D13 ; also sheet 2
COL_B: U$1.A0 ; also sheet 2
COL_C: U$1.A1 ; also sheet 2
CTRLBUTTON_OUT: U$1.D4 ; also sheet 3
DTR: JP1.6 U$1.DTR ; also sheet 5
ENCODER_A: U$1.D2 ; also sheet 3
ENCODER_B: U$1.D6 ; also sheet 3
GATE_OUT: U$1.D5 ; also sheet 3
GND: JP1.1 JP1.2 PAIRING_CONN_IN.4 PAIRING_CONN_OUT.4 U$1.GND U$1.GND1(GND2) U$1.GND2(GND3) U$1.GND3(GND4) U$1.GND4(GND1) ; also sheet 1,2,3,5,6
JACKSI/O: U$1.A2 ; also sheet 3
LED_DATA: U$1.D3 ; also sheet 1
PAIRING_CONN_PIN_IN: PAIRING_CONN_IN.1 U$1.D8
PAIRING_CONN_PIN_OUT: PAIRING_CONN_OUT.1 U$1.D7
ROW_A: U$1.D10 ; also sheet 2,3
ROW_B: U$1.D11 ; also sheet 2,3
ROW_C: U$1.D12 ; also sheet 2,3
ROW_OUT: U$1.D9 ; also sheet 2
RX: JP1.4 PAIRING_CONN_IN.2 PAIRING_CONN_OUT.3 U$1.RX1 U$1.RX1-1 ; also sheet 5
SWING: U$1.A6 ; also sheet 3
TX: JP1.5 PAIRING_CONN_IN.3 PAIRING_CONN_OUT.2 U$1.TX0 U$1.TX0-1 ; also sheet 5
Unconnected: U$1.RST U$1.RST1

## Sheet 5 of 6: programmer
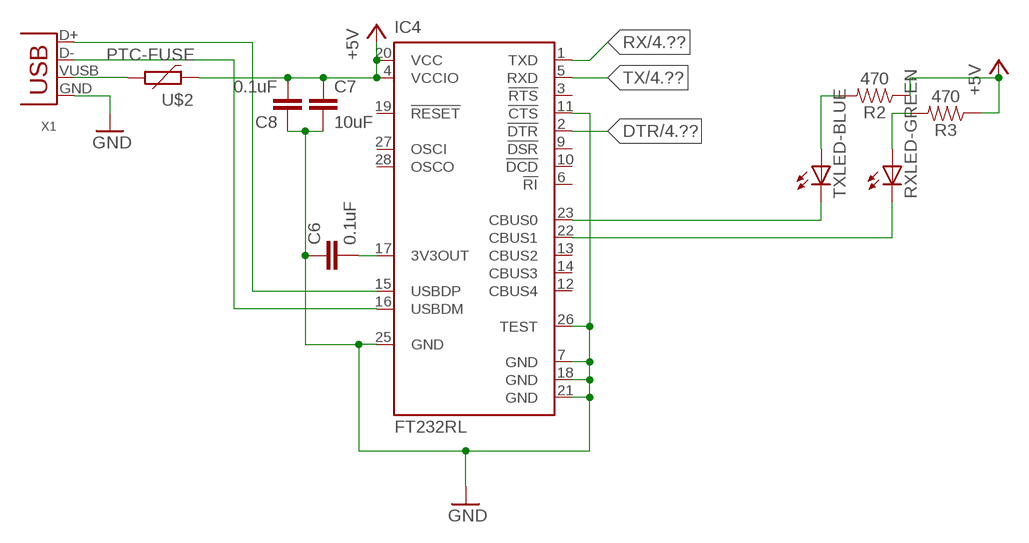
[diagram p4: schematic, sheet 5]

### Parts
C6  0.1uF  0.1UF-0603-25V-(+80/-20%)  [0603]
C7  10uF  10UF-0603-6.3V-20%  [0603]
C8  0.1uF  0.1UF-0603-25V-(+80/-20%)  [0603]
IC4  FT232RL  [SSOP28]
R2  470  470OHM-0603-1/10W-1%  [0603]
R3  470  470OHM-0603-1/10W-1%  [0603]
RXLED-GREEN  LEDCHIP-LED0603  [CHIP-LED0603]
TXLED-BLUE  LEDCHIP-LED0603  [CHIP-LED0603]
U$2  PTC-FUSE  [1206]
X1  USB-B-S  [USB-B-SMT]

### Nets
+5V: C7.1 C8.2 IC4.4(VCCIO) IC4.20(VCC) R2.1 R3.1 U$2.1 ; also sheet 2,3,4,6
DTR: IC4.2(!DTR) ; also sheet 4
GND: C6.1 C7.2 C8.1 IC4.7(GND) IC4.11(!CTS) IC4.18(GND) IC4.21(GND) IC4.25(GND) IC4.26(TEST) X1.GND ; also sheet 1,2,3,4,6
N$43: R2.2 TXLED-BLUE.A
N$44: R3.2 RXLED-GREEN.A
N$52: U$2.2 X1.VUSB(VBUS)
N$53: IC4.23(CBUS0) TXLED-BLUE.C
N$54: IC4.22(CBUS1) RXLED-GREEN.C
N$57: IC4.15(USBDP) X1.D+
N$58: IC4.16(USBDM) X1.D-
N$59: C6.2 IC4.17(3V3OUT)
RX: IC4.1(TXD) ; also sheet 4
TX: IC4.5(RXD) ; also sheet 4
Unconnected: IC4.3(!RTS) IC4.6(!RI) IC4.9(!DSR) IC4.10(!DCD) IC4.12(CBUS4) IC4.13(CBUS2) IC4.14(CBUS3) IC4.19(!RESET) IC4.27(OSCI) IC4.28(OSCO)

## Sheet 6 of 6: supply
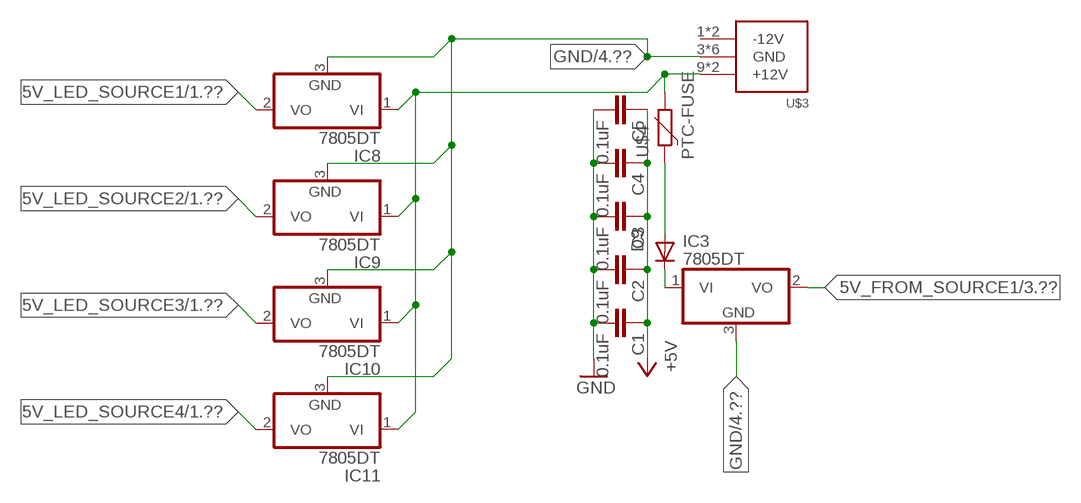
[diagram p5: schematic, sheet 6]

### Parts
C1  0.1uF  0.1UF-0603-25V-(+80/-20%)  [0603]
C2  0.1uF  0.1UF-0603-25V-(+80/-20%)  [0603]
C3  0.1uF  0.1UF-0603-25V-(+80/-20%)  [0603]
C4  0.1uF  0.1UF-0603-25V-(+80/-20%)  [0603]
C5  0.1uF  0.1UF-0603-25V-(+80/-20%)  [0603]
D9  1N5819HW  DIODE-SOD123  [SOD123]
IC3  7805DT  [TO252]
IC8  7805DT  [TO252]
IC9  7805DT  [TO252]
IC10  7805DT  [TO252]
IC11  7805DT  [TO252]
U$3  POWER_SIMPLE10  [POWER_10]
U$4  PTC-FUSE  [1206]

### Nets
5V_FROM_SOURCE1: IC3.2(VO) ; also sheet 3,4
5V_LED_SOURCE1: IC8.2(VO) ; also sheet 1
5V_LED_SOURCE2: IC9.2(VO) ; also sheet 1
5V_LED_SOURCE3: IC10.2(VO) ; also sheet 1
5V_LED_SOURCE4: IC11.2(VO) ; also sheet 1
+5V: C1.1 C2.1 C3.1 C4.1 C5.1 ; also sheet 2,3,4,5
GND: C1.2 C2.2 C3.2 C4.2 C5.2 IC3.3(GND) IC8.3(GND) IC9.3(GND) IC10.3(GND) IC11.3(GND) U$3.3(GND) U$3.4(GND) U$3.5(GND) U$3.6(GND) U$3.7(GND) U$3.8(GND) ; also sheet 1,2,3,4,5
N$113: IC8.1(VI) IC9.1(VI) IC10.1(VI) IC11.1(VI) U$3.9(+12V) U$3.10(+12V) U$4.2
N$118: D9.A U$4.1
N$119: D9.C IC3.1(VI)
Unconnected: U$3.1(-12V) U$3.2(-12V)

## Power pins joined to a net without a drawn wire
GND: IC1.8(GND) IC2.8(GND) IC5.8(GND) IC6.8(GND) IC7.8(GND)
VCC: IC1.16(VCC) IC2.16(VCC) IC5.16(VCC) IC6.16(VCC) IC7.16(VCC)
VEE: IC1.7(VEE) IC2.7(VEE) IC5.7(VEE) IC6.7(VEE) IC7.7(VEE)

## Library data of the parts
ANIMATION_AMMOUNT SWING = pot-alps:POT_US
ANIMATION_IN CLOCK_IN CLOCK_OUT OUT1-OUT8 RESET_IN RESET_OUT = og-pj301:PJ301_THONKICONN
C1-C6 C8 = SparkFun-Capacitors:0.1UF: 0.1µF ceramic capacitors A capacitor is a passive two-terminal electrical component used to store electrical energy temporarily in an electric field.; PROD_ID: CAP-00810
C7 = SparkFun-Capacitors:10UF: 10.0µF ceramic capacitors A capacitor is a passive two-terminal electrical component used to store electrical energy temporarily in an electric field.; PROD_ID: CAP-11015
CLOCK_LED OUT1_LED OUT2_LED OUT3_LED OUT4_LED OUT5_LED OUT6_LED OUT7_LED OUT8_LED = led:LED: LED
D1-D9 D11 D13-D16 = diode:DIODE-: DIODE
IC1 IC2 IC5-IC7 = 40xx:4051: 8-channel ANALOG MULTIPLEXER
IC3 IC8-IC11 = adafruit:78*: Positive VOLTAGE REGULATOR Added bigger pads to the TO-92 package
IC4 = ftdichip:FT232R: Source: http://www.ftdichip.com/Documents/DataSheets/DS_FT232R_v104.pdf; MPN: FT232RL; OC_FARNELL: 1146032; OC_NEWARK: 91K9918
JP1 = pinhead:PINHD-1X6: PIN HEADER
LED1-LED72 = adafruit:WS2812B
PAIRING_CONN_IN PAIRING_CONN_OUT = pinhead:PINHD-1X4: PIN HEADER
R1 R13-R20 R28 R41 R43 = SparkFun-Resistors:10KOHM: 10kΩ resistor A resistor is a passive two-terminal electrical component that implements electrical resistance as a circuit element. Resistors act to reduce current flow, and, at the same time, act to lower voltage levels within circuits. - Wikipedia; PROD_ID: RES-00824
R2-R4 R21-R27 R51 = SparkFun-Resistors:470OHM: 470Ω resistor A resistor is a passive two-terminal electrical component that implements electrical resistance as a circuit element. Resistors act to reduce current flow, and, at the same time, act to lower voltage levels within circuits. - Wikipedia; PROD_ID: RES-07869
R5-R12 R30 R32-R35 = SparkFun-Resistors:100OHM: 100Ω resistor A resistor is a passive two-terminal electrical component that implements electrical resistance as a circuit element. Resistors act to reduce current flow, and, at the same time, act to lower voltage levels within circuits. - Wikipedia; PROD_ID: RES-12438
RXLED-GREEN TXLED-BLUE = adafruit:LED: LED
S1-S72 = SparkFun-Switches:MOMENTARY-SWITCH-SPST: Momentary Switch (Pushbutton) - SPST Normally-open (NO) SPST momentary switches (buttons, pushbuttons). Variants PTH-12MM - 12mm square, through-hole Momentary Pushbutton Switch - 12mm Square <https://www.sparkfun.com/products/9190> (COM-09190) PTH-6.0MM, PTH-6.0MM-KIT - 6.0mm square, through-hole Mini Pushbutton Switch <https://www.sparkfun.com/products/97> (COM-00097) KIT package intended for soldering kit's - only one side of pads' copper is exposed. PTH-RIGHT-ANGLE-KIT - Right-angle, through-hole Right Angle Tactile Button <https://www.sparkfun.com/products/10791> - Used on SparkFun BigTime Watch Kit <https://www.sparkfun.com/products/11734> SMD-12MM - 12mm square, surface-mount Tactile Button - SMD (12mm) <https://www.sparkfun.com/products/12993> (COM-12993) Used on SparkFun PicoBoard <https://www.sparkfun.com/products/11888> SMD-4.5MM - 4.5mm Square Trackball Switch Used on SparkFun Blackberry Trackballer Breakout <https://www.sparkfun.com/products/13169> SMD-4.6MMX2.8MM - 4.60mm x 2.80mm, surface mount Used on SparkFun SAMD21 Mini Breakout <https://www.sparkfun.com/products/13664> SMD-5.2MM, SMD-5.2-REDUNDANT - 5.2mm square, surface-mount Mini Pushbutton Switch - SMD <https://www.sparkfun.com/products/8720> (COM-08720) Used on Arduino Pro Mini <https://www.sparkfun.com/products/11114> REDUNDANT package connects both switch circuits together SMD-6.0X3.5MM - 6.0 x 3.5mm, surface mount Momentary Reset Switch SMD <https://www.sparkfun.com/products/8229> (COM-08229) SMD-6.2MM-TALL - 6.2mm square, surface mount Tactile Button - SMD (6mm) <https://www.sparkfun.com/products/12992> Used on SparkFun Digital Sandbox <https://www.sparkfun.com/products/12651> SMD-RIGHT-ANGLE - Right-angle, surface mount Used on SparkFun Block for Intel® Edison - Arduino <https://www.sparkfun.com/products/13036>; PROD_ID: SWCH-00815; SF_SKU: COM-08229
SW1 = piher:CI-11: 11mm Incemental Encoder Source: www.piher.net .. 04-CI-11v04.pdf; OC_FARNELL: unknown; OC_NEWARK: unknown
U$1 = Arduino-clone:ABK-PRO-MINI: ABK Pro-Mini Arduino Clone
U$2 U$4 = ptc-fuse-1206-smd:PTC-FUSE
U$3 = eurorack:POWER_SIMPLE
X1 = con-usb-3:USB: USB Connectors

## Net classes
0 default: width 0.254 mm
1 5V: width 0.305 mm